# EAGLE design fm (EAGLE 6.5.0)
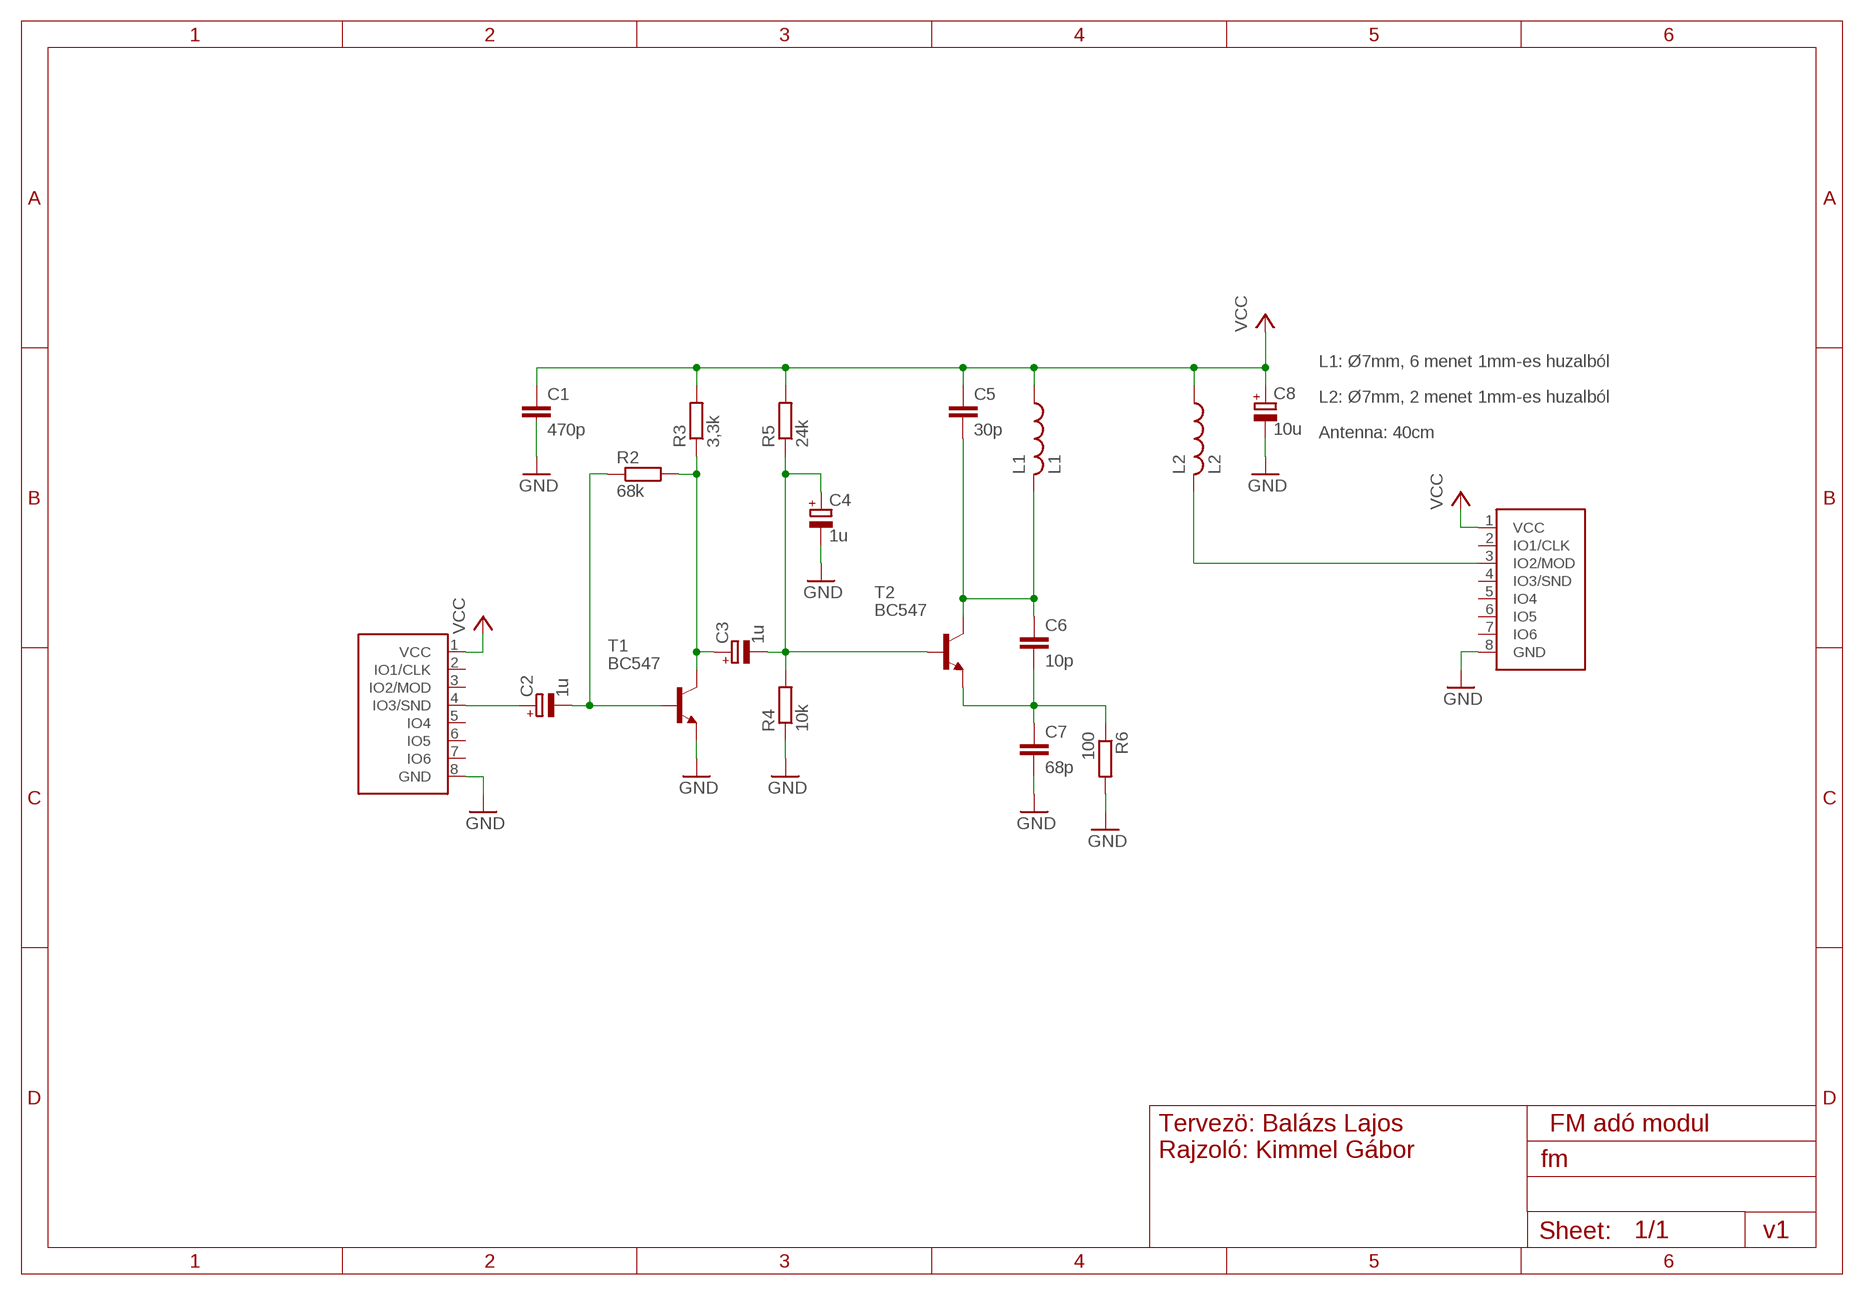
[diagram p0: schematic, sheet 1]

## Parts
C1  470p  C-EU075-032X103  [C075-032X103]
C2  1u  CPOL-EUE2.5-7  [E2,5-7]
C3  1u  CPOL-EUE2.5-7  [E2,5-7]
C4  1u  CPOL-EUE2.5-7  [E2,5-7]
C5  30p  C-EU075-032X103  [C075-032X103]
C6  10p  C-EU075-032X103  [C075-032X103]
C7  68p  C-EU075-032X103  [C075-032X103]
C8  10u  CPOL-EUE2.5-7  [E2,5-7]
L1  L1  L-US0207/7  [0207/7]
L2  L2  L-US0207/7  [0207/7]
R2  68k  R-EU_0309/12  [0309/12]
R3  3,3k  R-EU_0309/12  [0309/12]
R4  10k  R-EU_0309/12  [0309/12]
R5  24k  R-EU_0309/12  [0309/12]
R6  100  R-EU_0309/12  [0309/12]
T1  BC547  BC237-NPN-TO92-CBE  [TO92-CBE]
T2  BC547  BC237-NPN-TO92-CBE  [TO92-CBE]
U$1  GANZ-CONNECTOR  [FE08W]
U$2  GANZ-CONNECTOR-OUT  [MA08-1W]

## Nets
GND: C1.2 C4.- C7.2 C8.- R4.1 R6.2 T1.E U$1.8(GND) U$2.8(GND)
N$2: C2.+ U$1.4(IO3/SND)
N$3: C2.- R2.1 T1.B
N$4: C3.+ R2.2 R3.1 T1.C
N$5: C3.- C4.+ R4.2 R5.1 T2.B
N$7: C6.2 C7.1 R6.1 T2.E
N$8: C5.2 C6.1 L1.2 T2.C
N$9: L2.2 U$2.3(IO2/MOD)
VCC: C1.1 C5.1 C8.+ L1.1 L2.1 R3.2 R5.2 U$1.1(VCC) U$2.1(VCC)
Unconnected: U$1.2(IO1/CLK) U$1.3(IO2/MOD) U$1.5(IO4) U$1.6(IO5) U$1.7(IO6) U$2.2(IO1/CLK) U$2.4(IO3/SND) U$2.5(IO4) U$2.6(IO5) U$2.7(IO6)

## Notes on the sheet
- L1: Ø7mm, 6 menet 1mm-es huzalból
- L2: Ø7mm, 2 menet 1mm-es huzalból
- Antenna: 40cm
- Tervezö: Balázs Lajos
  Rajzoló: Kimmel Gábor
- FM adó modul
- v1

## Library data of the parts
C1 C5-C7 = resistor:C-EU: CAPACITOR, European symbol
C2-C4 C8 = resistor:CPOL-EU: POLARIZED CAPACITOR, European symbol
L1 L2 = resistor:L-US: INDUCTOR, American symbol
R2-R6 = resistor:R-EU_: RESISTOR, European symbol
T1 T2 = transistor:*-NPN-: NPN Transistror BF959 corrected 2008.03.06
U$1 = ganzlib:GANZ-CONNECTOR
U$2 = ganzlib:GANZ-CONNECTOR-OUT

## Board
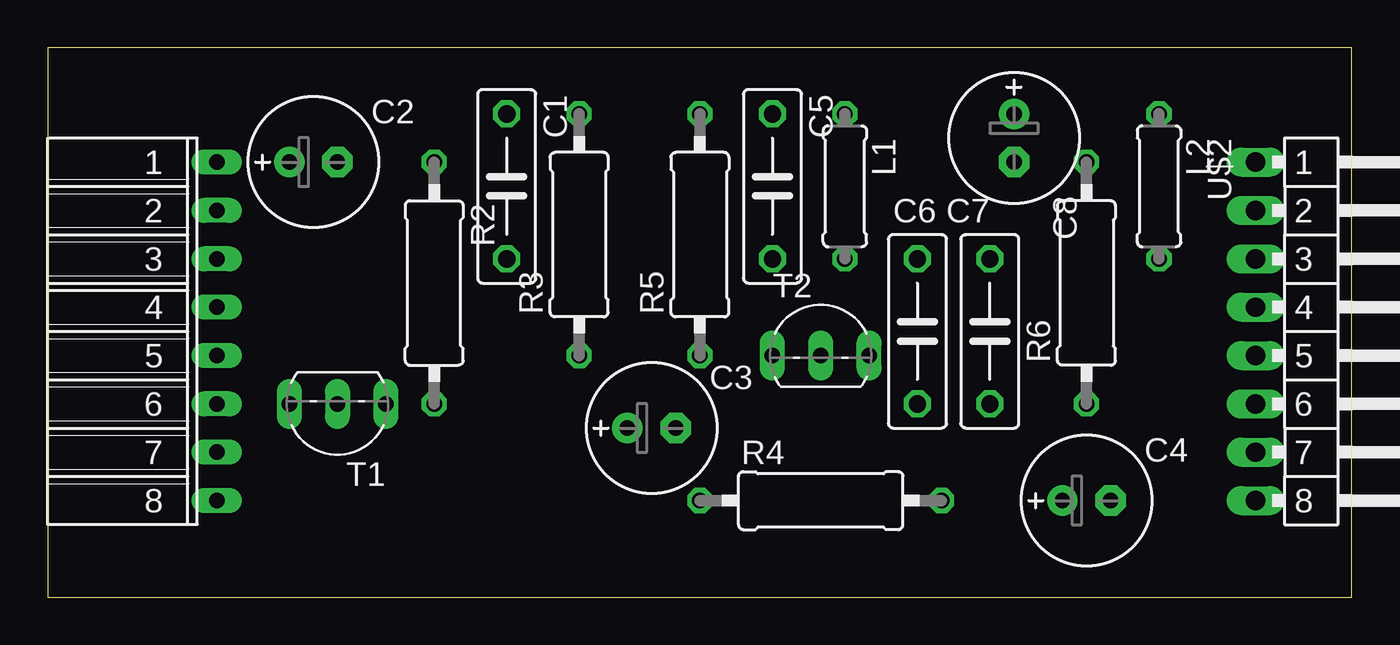
[diagram p1: board, top side]
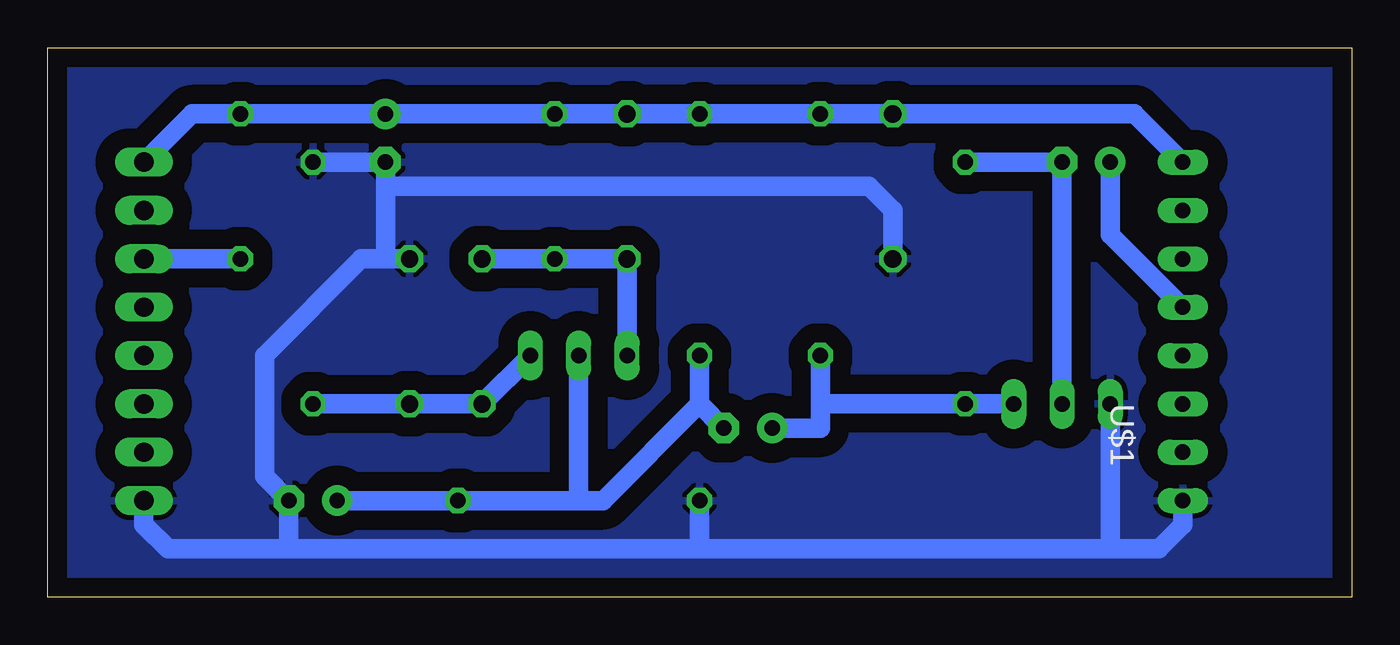
[diagram p2: board, bottom side, seen from below]

Size 68.56 x 28.88 mm. Coordinates in mm from the lower left corner, seen from the top.
Outline: 0,0 68.56,0 68.56,28.88 0,28.88 0,0
Copper layers (1*16): Top 0.035mm / dielectric 1.5mm / Bottom 0.035mm
Design rules "default *": minimum track width 10mil, minimum drill 24mil, track to track 8mil, track to pad 8mil, pad to pad 8mil, via to via 8mil, smd to smd 8mil, copper to edge 40mil, drill to drill 8mil, minimum pad ring 10mil, minimum via ring 8mil, stop-mask expansion 4mil, vias tented up to drill 0mil, thermal gap 10mil

### Footprints (pad centres in the part's own frame; a part is rotated, then mirrored left to right if it is on the bottom)
C075-032X103 = drill 0.914 octagon: 1 -3.81,0; 2 3.81,0
E2,5-7 = drill 0.813 pad 1.6: + -1.27,0 | drill 0.813 pad 1.6 octagon: - 1.27,0
0207/7 = drill 0.813 octagon: 1 -3.81,0; 2 3.81,0
0309/12 = drill 0.813 octagon: 1 -6.35,0; 2 6.35,0
TO92-CBE = drill 0.813 long: B 0,0; C -2.54,0; E 2.54,0
FE08W = drill 0.813 long: 1 5.08,8.89; 2 5.08,6.35; 3 5.08,3.81; 4 5.08,1.27; 5 5.08,-1.27; 6 5.08,-3.81; 7 5.08,-6.35; 8 5.08,-8.89
MA08-1W = drill 1.016 long: 1 0,8.89; 2 0,6.35; 3 0,3.81; 4 0,1.27; 5 0,-1.27; 6 0,-3.81; 7 0,-6.35; 8 0,-8.89

### Placement (x,y rotation side)
C1  24.13,21.59 270 top
C2  13.97,22.86 0 top
C3  31.75,8.89 0 top
C4  54.61,5.08 0 top
C5  38.1,21.59 270 top
C6  45.72,13.97 270 top
C7  49.53,13.97 90 top
C8  50.8,24.13 270 top
L1  41.91,21.59 270 top
L2  58.42,21.59 270 top
R2  20.32,16.51 270 top
R3  27.94,19.05 90 top
R4  40.64,5.08 0 top
R5  34.29,19.05 90 top
R6  54.61,16.51 90 top
T1  15.24,10.16 180 top
T2  40.64,12.7 0 top
U$1  3.81,13.97 0 top
U$2  63.5,13.97 0 top

### Tracks (layer width: path | path; a pad name or v marks a point on that pad's centre or on a via)
GND
  Bottom 1.016: 50.8,21.59 C8.- R6.2 | T1.E 12.7,2.54 | 12.7,2.54 34.29,2.54 | 34.29,2.54 55.88,2.54 | R4.1 34.29,2.54 | C1.2 24.13,20.32 25.4,21.59 50.8,21.59 | U$1.8 8.89,3.81 10.16,2.54 12.7,2.54 | U$2.8 63.5,3.81 62.23,2.54 55.88,2.54 | 55.88,2.54 C4.- 57.15,6.35 57.15,12.7 52.07,17.78 50.8,17.78 | 50.8,17.78 C7.2 | 50.8,21.59 50.8,17.78
  pour Bottom (isolate 1.016): 0,29.21 68.58,29.21 68.58,0 0,0
N$2
  Bottom 1.016: U$1.4 12.7,19.05 C2.+
N$3
  Bottom 1.016: R2.1 C2.- T1.B
N$4
  Bottom 1.016: C3.+ 27.94,8.89 27.94,10.16 | R3.1 27.94,10.16 | T1.C R2.2 27.94,10.16
N$5
  Bottom 1.016: C4.+ R4.2 40.64,5.08 | R5.1 34.29,10.16 | 34.29,10.16 C3.- | 40.64,5.08 39.37,5.08 34.29,10.16 | T2.B 40.64,5.08
N$7
  Bottom 1.016: R6.1 C7.1 C6.2 T2.E
N$8
  Bottom 1.016: T2.C C5.2 L1.2 C6.1
N$9
  Bottom 1.016: L2.2 U$2.3
VCC
  Bottom 1.016: U$1.1 11.43,25.4 C1.1 R3.2 R5.2 C5.1 L1.1 C8.+ L2.1 60.96,25.4 U$2.1